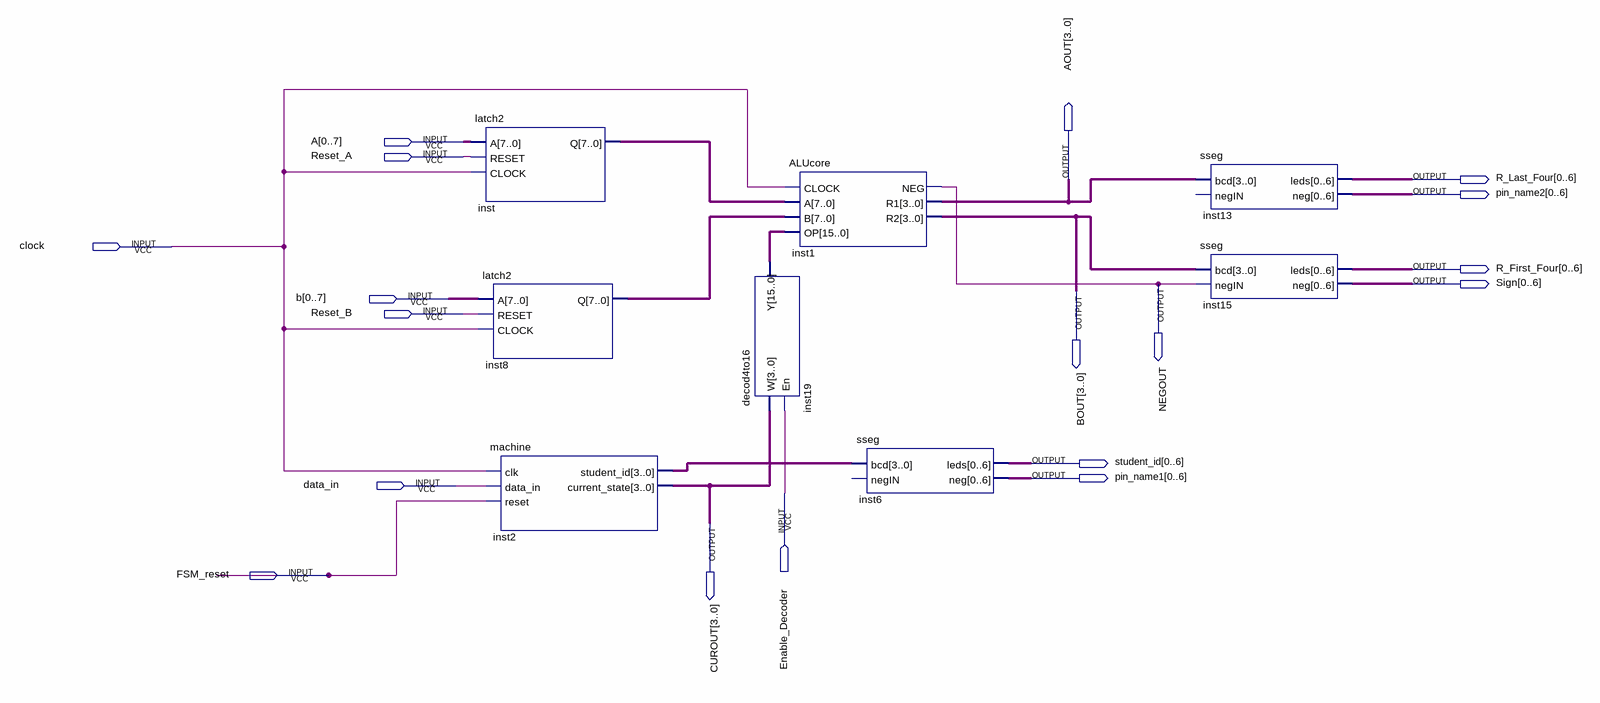
[diagram p0: schematic sheet]
// Quartus schematic Lab6.bdf as structural Verilog: 8 symbols, 18 pins
module Lab6 (
  input  [0:7] A,
  input  Reset_A,
  input  clock,
  input  [0:7] b,
  input  Reset_B,
  input  data_in,
  input  Enable_Decoder,
  input  FSM_reset,
  output [3:0] AOUT,
  output [0:6] R_Last_Four,
  output [0:6] pin_name2,
  output [0:6] R_First_Four,
  output NEGOUT,
  output [0:6] Sign,
  output [3:0] BOUT,
  output [0:6] student_id,
  output [0:6] pin_name1,
  output [3:0] CUROUT
);

  wire [3:0] inst2_student_id;
  wire [7:0] inst8_q, inst_q;
  wire [15:0] inst19_y;

  latch2 inst (.A(A), .RESET(Reset_A), .CLOCK(clock), .Q(inst_q));
  latch2 inst8 (.A(b), .RESET(Reset_B), .CLOCK(clock), .Q(inst8_q));
  machine inst2 (
    .clk(clock), .data_in(data_in), .reset(FSM_reset), .student_id(inst2_student_id), .current_state(CUROUT));
  decod4to16 inst19 (.W(CUROUT), .En(Enable_Decoder), .Y(inst19_y));
  ALUcore inst1 (.CLOCK(clock), .A(inst_q), .B(inst8_q), .OP(inst19_y), .NEG(NEGOUT), .R1(AOUT), .R2(BOUT));
  sseg inst6 (.bcd(inst2_student_id), .leds(student_id), .neg(pin_name1));  // open: negIN
  sseg inst13 (.bcd(AOUT), .leds(R_Last_Four), .neg(pin_name2));  // open: negIN
  sseg inst15 (.bcd(BOUT), .negIN(NEGOUT), .leds(R_First_Four), .neg(Sign));
endmodule
